# Altium project USB-C_Power_Measurement.PrjPcb
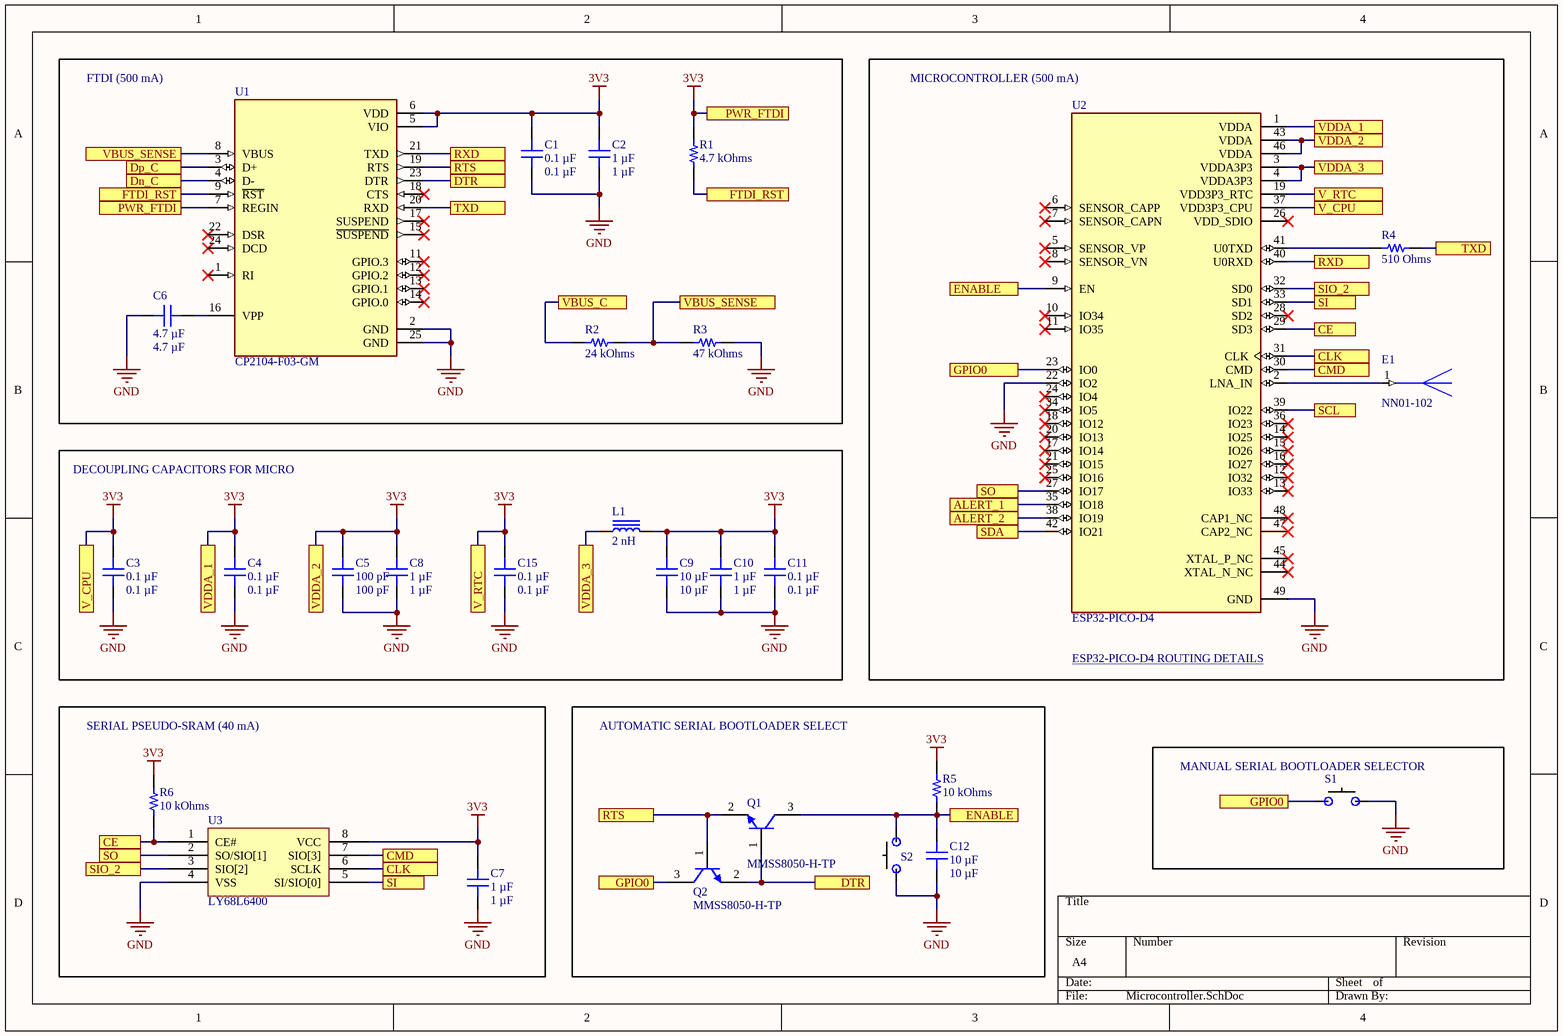
[diagram p0: Microcontroller.SchDoc]
4 sheets, 69 parts. Net scope: flat (ports and power ports of the same name join across sheets).
Board file: PCB_Power_Measurement.PcbDoc
Sheets:
  Microcontroller.SchDoc
  USB-C_Connectors.SchDoc
  Power_Regulation.SchDoc
  Power_Measurement.SchDoc

## Sheet Microcontroller.SchDoc
size A4

### Parts
C1  0.1 µF  [CAP 0603_1608]
C2  1 µF  [CAP 0603_1608]
C3  0.1 µF  [CAP 0603_1608]
C4  0.1 µF  [CAP 0603_1608]
C5  100 pF  [CAP 0603_1608]
C6  4.7 µF  [CAP 0603_1608]
C7  1 µF  [CAP 0603_1608]
C8  1 µF  [CAP 0603_1608]
C9  10 µF  [CAP 0805_2012]
C10  1 µF  [CAP 0603_1608]
C11  0.1 µF  [CAP 0603_1608]
C12  10 µF  [CAP 0805_2012]
C15  0.1 µF  [CAP 0603_1608]
E1  NN01-102  [XCVR_NN01-102]
L1  2 nH  [IND 0402_1005]
Q1  MMSS8050-H-TP  [MCCSEMI SOT-23-3]
Q2  MMSS8050-H-TP  [MCCSEMI SOT-23-3]
R1  4.7 kOhms  [RES 0603_1608]
R2  24 kOhms  [RES 0603_1608]
R3  47 kOhms  [RES 0603_1608]
R4  510 Ohms  [RES 0603_1608]
R5  10 kOhms  [RES 0603_1608]
R6  10 kOhms  [RES 0603_1608]
S1  GT-TC029B-H025-L1N  [GT-TC029B-H025-L1N]  (value not drawn)
S2  GT-TC029B-H025-L1N  [GT-TC029B-H025-L1N]  (value not drawn)
U1  CP2104-F03-GM  [QFN50P400X400X80-25N]
U2  ESP32-PICO-D4  [PQFN50P700X700X104-49N]
U3  LY68L6400  [SOP-8_3.9x4.9x1.27P]

### Blocks framed on the sheet
FTDI (500 mA): C1 C2 C6 R1-R3 U1
DECOUPLING CAPACITORS FOR MICRO: C3-C5 C8-C11 C15 L1
SERIAL PSEUDO-SRAM (40 mA): C7 R6 U3
AUTOMATIC SERIAL BOOTLOADER SELECT: C12 Q1 Q2 R5 S2
MANUAL SERIAL BOOTLOADER SELECTOR: S1

### Ports
ALERT_1, ALERT_2, CE, CLK, CMD, Dn_C, Dp_C, DTR, ENABLE, FTDI_RST, GPIO0, PWR_FTDI, RTS, RXD, SCL, SDA, SI, SIO_2, SO, TXD, V_CPU, V_RTC, VBUS_C, VBUS_SENSE, VDDA_1, VDDA_2, VDDA_3

### Nets
3V3: C1.2 C2.1 C3.2 C4.1 C5.2 C7.1 C8.2 C9.2 C10.2 C11.2 C15.2 L1.2 R1.2 R5.1 R6.1 U1.5(VIO) U1.6(VDD) U1.7(REGIN) U2.1(VDDA) U2.19(VDD3P3_RTC) U2.37(VDD3P3_CPU) U2.43(VDDA) U2.46(VDDA) U3.8(VCC) ; port PWR_FTDI, port V_CPU, port VDDA_1, port VDDA_2, port V_RTC
GND: C1.1 C2.2 C3.1 C4.2 C5.1 C6.2 C7.2 C8.1 C9.1 C10.1 C11.1 C12.1 C15.1 R3.1 S1.2 S2.1 U1.2(GND) U1.25(GND) U2.22(IO2) U2.49(GND) U3.4(VSS)
NetC6_1: C6.1 U1.16(VPP)
NetC12_2: C12.2 Q1.3(C) R5.2 S2.2 U2.9(EN) ; port ENABLE
NetD1_1: U1.3(D+) ; port Dp_C
NetD2_1: U1.4(D-) ; port Dn_C
NetE1_1: E1.1 U2.2(LNA_IN)
NetJ3_A4: R2.2 ; port VBUS_C
NetL1_1: L1.1 U2.3(VDDA3P3) U2.4(VDDA3P3) ; port VDDA_3
NetQ1_1: Q1.1(B) Q2.2(E) U1.23(DTR) ; port DTR
NetQ1_2: Q1.2(E) Q2.1(B) U1.19(RTS) ; port RTS
NetQ2_3: Q2.3(C) S1.1 U2.23(IO0) ; port GPIO0
NetR1_1: R1.1 U1.9(~{RST}) ; port FTDI_RST
NetR2_1: R2.1 R3.2 U1.8(VBUS) ; port VBUS_SENSE
NetR4_1: R4.1 U2.41(U0TXD)
NetR4_2: R4.2 U1.20(RXD) ; port TXD
NetR6_2: R6.2 U2.29(SD3) U3.1(CE#) ; port CE
NetR10_2: U2.42(IO21) ; port SDA
NetR11_2: U2.39(IO22) ; port SCL
NetR12_2: U2.35(IO18) ; port ALERT_1
NetR13_2: U2.38(IO19) ; port ALERT_2
NetU1_21: U1.21(TXD) U2.40(U0RXD) ; port RXD
NetU2_27: U2.27(IO17) U3.2(SO/SIO[1]) ; port SO
NetU2_30: U2.30(CMD) U3.7(SIO[3]) ; port CMD
NetU2_31: U2.31(CLK) U3.6(SCLK) ; port CLK
NetU2_32: U2.32(SD0) U3.3(SIO[2]) ; port SIO_2
NetU2_33: U2.33(SD1) U3.5(SI/SIO[0]) ; port SI

Not connected (* = marked no-connect by the designer): U1 1(RI)* 11(GPIO.3)* 12(GPIO.2)* 13(GPIO.1)* 14(GPIO.0)* 15(~{SUSPEND})* 17(SUSPEND)* 18(CTS)* 22(DSR)* 24(DCD)*; U2 5(SENSOR_VP)* 6(SENSOR_CAPP)* 7(SENSOR_CAPN)* 8(SENSOR_VN)* 10(IO34)* 11(IO35)* 12(IO32)* 13(IO33)* 14(IO25)* 15(IO26)* 16(IO27)* 17(IO14)* 18(IO12)* 20(IO13)* 21(IO15)* 24(IO4)* 25(IO16)* 26(VDD_SDIO)* 28(SD2)* 34(IO5)* 36(IO23)* 44(XTAL_N_NC)* 45(XTAL_P_NC)* 47(CAP2_NC)* 48(CAP1_NC)*

### Notes on the sheet
- (near U2) MICROCONTROLLER (500 mA)
- ESP32-PICO-D4 ROUTING DETAILS <https://espressif.com/sites/default/files/documentation/esp32_hardware_design_guidelines_en.pdf>

### Library data of the parts
C1 C3 C4 C11 C15 = C0603C104K5RAC7411: CAP CER 0.1UF 50V X7R 0603; manufacturer: KEMET; Tolerance: ±10%; Part Number: C0603C104K5RAC7411; Value: 0.1 µF; Applications: Bypass, Decoupling; Capacitance: 0.1 µF; componentlink1description: Datasheet; componentlink1url: https://api.kemet.com/component-edge/download/datasheet/C0603C104K5RAC7411.pdf; componentlink2description: DigiKey Link; componentlink2url: https://www.digikey.com/en/products/detail/kemet/C0603C104K5RAC7411/3317013; Device Package: 0603 (1608 Metric); lastupdated: 21/08/2022 8:00:52 PM; Lifecycle Status: Active; Minimum Order: 15000; Mounting Type: Surface Mount, MLCC; Operating Temperature: -55°C ~ 125°C; Package / Case: 0603 (1608 Metric); packaging: TapeAndReel; partid: 2233; Part Status: Active; price: 0.01; series: SMD Comm X7R; Size / Dimension: 0.063" L x 0.031" W (1.60mm x 0.80mm); Supplier 1: DigiKey; Supplier Part Number 1: 399-7374-2-ND; Temperature Coefficient: X7R; Thickness (Max): 0.035" (0.90mm); Voltage - Rated: 50V
C2 C7 C8 C10 = CC0603KRX7R6BB105: CAP CER 1UF 10V X7R 0603; manufacturer: Yageo; Tolerance: ±10%; Part Number: CC0603KRX7R6BB105; Value: 1 µF; Applications: General Purpose; Capacitance: 1 µF; componentlink1description: Datasheet; componentlink1url: https://www.yageo.com/upload/media/product/productsearch/datasheet/mlcc/UPY-GPHC_X7R_6.3V-to-50V_18.pdf; componentlink2description: DigiKey Link; componentlink2url: https://www.digikey.com/en/products/detail/yageo/CC0603KRX7R6BB105/5195204; Device Package: 0603 (1608 Metric); lastupdated: 21/08/2022 8:00:52 PM; Lifecycle Status: Active; Minimum Order: 1; Mounting Type: Surface Mount, MLCC; Operating Temperature: -55°C ~ 125°C; Package / Case: 0603 (1608 Metric); packaging: TapeAndReel; partid: 2290; Part Status: Active; price: 0.02; series: CC; Size / Dimension: 0.063" L x 0.031" W (1.60mm x 0.80mm); Supplier 1: DigiKey; Supplier Part Number 1: 311-1796-1-ND; Temperature Coefficient: X7R; Thickness (Max): 0.035" (0.90mm); Voltage - Rated: 10V
C5 = C0603C101K5GACAUTO: CAP CER 100PF 50V C0G/NP0 0603; manufacturer: KEMET; Temperature Coefficient: C0G, NP0; Tolerance: ±10%; Part Number: C0603C101K5GACAUTO; Value: 100 pF; Applications: Automotive; Capacitance: 100 pF; componentlink1description: Datasheet; componentlink1url: https://api.kemet.com/component-edge/download/datasheet/C0603C101K5GACAUTO.pdf; componentlink2description: DigiKey Link; componentlink2url: https://www.digikey.com/en/products/detail/kemet/C0603C101K5GACAUTO/3314842; Device Package: 0603 (1608 Metric); Features: Low ESL; lastupdated: 25/08/2022 6:49:41 AM; Lifecycle Status: Active; Minimum Order: 1; Mounting Type: Surface Mount, MLCC; Operating Temperature: -55°C ~ 125°C; Package / Case: 0603 (1608 Metric); packaging: TapeAndReel; partid: 2201; Part Status: Active; price: 0.01; Ratings: AEC-Q200; series: SMD Auto C0G; Size / Dimension: 0.063" L x 0.031" W (1.60mm x 0.80mm); Supplier 1: DigiKey; Supplier Part Number 1: 399-6843-1-ND; Thickness (Max): 0.034" (0.87mm); Voltage - Rated: 50V
C6 = GRM188Z71C475KE21J: CAP CER 4.7UF 16V X7R 0603; manufacturer: Murata Electronics; Tolerance: ±10%; Part Number: GRM188Z71C475KE21J; Value: 4.7 µF; Applications: General Purpose; Capacitance: 4.7 µF; componentlink1description: Datasheet; componentlink1url: https://search.murata.co.jp/Ceramy/image/img/A01X/G101/ENG/GRM188Z71C475KE21-01A.pdf; componentlink2description: DigiKey Link; componentlink2url: https://www.digikey.com/en/products/detail/murata-electronics/GRM188Z71C475KE21J/16033436; Device Package: 0603 (1608 Metric); lastupdated: 21/08/2022 7:59:26 PM; Lifecycle Status: Active; Minimum Order: 1; Mounting Type: Surface Mount, MLCC; Operating Temperature: -55°C ~ 125°C; Package / Case: 0603 (1608 Metric); packaging: TapeAndReel; partid: 41988; Part Status: Active; price: 0.04; series: GRM; Size / Dimension: 0.063" L x 0.031" W (1.60mm x 0.80mm); Supplier 1: DigiKey; Supplier Part Number 1: 490-GRM188Z71C475KE21JCT-ND; Temperature Coefficient: X7R; Thickness (Max): 0.039" (1.00mm); Voltage - Rated: 16V
C9 C12 = CGA4J1X7R0J106K125AC: CAP CER 10UF 6.3V X7R 0805; manufacturer: TDK Corporation; Tolerance: ±10%; Part Number: CGA4J1X7R0J106K125AC; Value: 10 µF; Applications: Automotive; Capacitance: 10 µF; componentlink1description: Datasheet; componentlink1url: https://product.tdk.com/info/en/catalog/datasheets/mlcc_automotive_general_en.pdf?ref_disty=digikey; componentlink2description: DigiKey Link; componentlink2url: https://www.digikey.com/en/products/detail/tdk-corporation/CGA4J1X7R0J106K125AC/2672864; Device Package: 0805 (2012 Metric); lastupdated: 21/08/2022 8:04:19 PM; Lifecycle Status: Active; Minimum Order: 1; Mounting Type: Surface Mount, MLCC; Operating Temperature: -55°C ~ 125°C; Package / Case: 0805 (2012 Metric); packaging: TapeAndReel; partid: 3016; Part Status: Active; price: 0.07; Ratings: AEC-Q200; series: CGA; Size / Dimension: 0.079" L x 0.049" W (2.00mm x 1.25mm); Supplier 1: DigiKey; Supplier Part Number 1: 445-6971-1-ND; Temperature Coefficient: X7R; Thickness (Max): 0.057" (1.45mm); Voltage - Rated: 6.3V
E1 = NN01-102: 2.45GHz Bluetooth, WLAN, Zigbee Chip RF Antenna 2.4GHz ~ 2.5GHz 1.7dBi Solder Surface Mount; MF: {'manufacturer': u'Ignion'}; Availability: Unavailable; Value: *; Price: None; MP: NN01-102; Package: None
L1 = MHQ1005P2N0BT000: FIXED IND 2NH 1A 50 MOHM SMD; Manufacturer: TDK Corporation; DC Resistance (DCR): 50mOhm Max; Frequency - Self Resonant: 8GHz; Inductance Frequency - Test: 100 MHz; Material - Core: Ceramic, Non-Magnetic; Q @ Freq: 23 @ 250MHz; Shielding: Unshielded; Tolerance: ±0.1nH; Type: Multilayer; Part Number: MHQ1005P2N0BT000; ComponentLink1Description: Datasheet; ComponentLink1URL: https://product.tdk.com/info/en/catalog/datasheets/inductor_commercial_high-frequency_mhq1005p_en.pdf?ref_disty=digikey; ComponentLink2Description: DigiKey Link; ComponentLink2URL: https://www.digikey.com/en/products/detail/tdk-corporation/MHQ1005P2N0BT000/4742522; Current Rating (Amps): 1 A; Device Package: 0402 (1005 Metric); Height - Seated (Max): 0.024" (0.60mm); Inductance: 2 nH; LastUpdated: 1/09/2022 1:22:23 PM; Lifecycle Status: Active; Minimum Order: 1; Mounting Type: Surface Mount; Operating Temperature: -55°C ~ 125°C; Package / Case: 0402 (1005 Metric); Packaging: TapeAndReel; PartId: 1330; Part Status: Active; Price: 0.06; Series: MHQ-P; Size / Dimension: 0.039" L x 0.024" W (1.00mm x 0.60mm); Supplier 1: DigiKey; Supplier Part Number 1: 445-MHQ1005P2N0BT000CT-ND; Supplier Device Package: 0402 (1005 Metric); Value: 2 nH
Q1 Q2 = MMSS8050-H-TP: TRANS NPN 25V 1.5A SOT23; Manufacturer: Micro Commercial Co; Current - Collector Cutoff (Max): 100nA; DC Current Gain (hFE) (Min) @ Ic, Vce: 120 @ 100mA, 1V; Frequency - Transition: 100MHz; Power - Max: 625 mW; Vce Saturation (Max) @ Ib, Ic: 500mV @ 80mA, 800mA; Part Number: MMSS8050-H-TP; ComponentLink1Description: Datasheet; ComponentLink1URL: https://www.mccsemi.com/pdf/Products/MMSS8050(SOT-23).pdf; ComponentLink2Description: DigiKey Link; ComponentLink2URL: https://www.digikey.com/en/products/detail/micro-commercial-co/MMSS8050-H-TP/2696476; Current - Collector (Ic) (Max): 1.5 A; LastUpdated: 21/08/2022 9:04:56 PM; Lifecycle Status: Active; Minimum Order: 1; Mounting Type: Surface Mount; Operating Temperature: -55°C ~ 150°C (TJ); Package / Case: TO-236-3, SC-59, SOT-23-3; Packaging: TapeAndReel; PartId: 279; Part Status: Active; Price: 0.03; Series: -; Supplier 1: DigiKey; Supplier Part Number 1: MMSS8050-H-TPMSCT-ND; Supplier Device Package: SOT-23; Transistor Type: NPN; Voltage - Collector Emitter Breakdown (Max): 25 V
R1 = RT0603FRE074K7L: RES SMD 4.7K OHM 1% 1/10W 0603; Manufacturer: Yageo; Power (Watts): 0.1W, 1/10W; Temperature Coefficient: ±50ppm/°C; Part Number: RT0603FRE074K7L; Value: 4.7 kOhms; ComponentLink1Description: Datasheet; ComponentLink1URL: https://www.yageo.com/upload/media/product/productsearch/datasheet/rchip/PYu-RT_1-to-0.01_RoHS_L_11.pdf; ComponentLink2Description: DigiKey Link; ComponentLink2URL: https://www.digikey.com/en/products/detail/yageo/RT0603FRE074K7L/1075404; Composition: Thin Film; Device Package: 0603 (1608 Metric); Height - Seated (Max): 0.022" (0.55mm); LastUpdated: 21/08/2022 8:23:08 PM; Lifecycle Status: Active; Minimum Order: 1; Number of Terminations: 2; Operating Temperature: -55°C ~ 155°C; Package / Case: 0603 (1608 Metric); Packaging: TapeAndReel; PartId: 5678; Part Status: Active; Price: 0.01; Resistance: 4.7 kOhms; Series: RT; Size / Dimension: 0.063" L x 0.031" W (1.60mm x 0.80mm); Supplier 1: DigiKey; Supplier Part Number 1: YAG1238CT-ND; Supplier Device Package: 0603; Tolerance: ±1%
R2 = RK73H1JTTD2402F: RES 24K OHM 1% 1/10W 0603; Manufacturer: KOA Speer Electronics, Inc.; Power (Watts): 0.1W, 1/10W; Temperature Coefficient: ±100ppm/°C; Part Number: RK73H1JTTD2402F; Value: 24 kOhms; ComponentLink1Description: Datasheet; ComponentLink1URL: http://www.koaspeer.com/catimages/Products/RK73H/RK73H.pdf; ComponentLink2Description: DigiKey Link; ComponentLink2URL: https://www.digikey.com/en/products/detail/koa-speer-electronics-inc/RK73H1JTTD2402F/9844964; Composition: Thick Film; Device Package: 0603 (1608 Metric); Features: Automotive AEC-Q200, Moisture Resistant; Height - Seated (Max): 0.022" (0.55mm); LastUpdated: 21/08/2022 8:23:10 PM; Lifecycle Status: Active; Minimum Order: 1; Number of Terminations: 2; Operating Temperature: -55°C ~ 155°C; Package / Case: 0603 (1608 Metric); Packaging: CutTape; PartId: 5156; Part Status: Active; Price: 0.01; Ratings: AEC-Q200; Resistance: 24 kOhms; Series: RK73H; Size / Dimension: 0.063" L x 0.031" W (1.60mm x 0.80mm); Supplier 1: DigiKey; Supplier Part Number 1: 2019-RK73H1JTTD2402FCT-ND; Supplier Device Package: 0603; Tolerance: ±1%
R3 = RT0603FRE0747KL: RES SMD 47K OHM 1% 1/10W 0603; Manufacturer: Yageo; Power (Watts): 0.1W, 1/10W; Temperature Coefficient: ±50ppm/°C; Part Number: RT0603FRE0747KL; Value: 47 kOhms; ComponentLink1Description: Datasheet; ComponentLink1URL: https://www.yageo.com/upload/media/product/productsearch/datasheet/rchip/PYu-RT_1-to-0.01_RoHS_L_11.pdf; ComponentLink2Description: DigiKey Link; ComponentLink2URL: https://www.digikey.com/en/products/detail/yageo/RT0603FRE0747KL/1075386; Composition: Thin Film; Device Package: 0603 (1608 Metric); Height - Seated (Max): 0.022" (0.55mm); LastUpdated: 21/08/2022 8:23:08 PM; Lifecycle Status: Active; Minimum Order: 1; Number of Terminations: 2; Operating Temperature: -55°C ~ 155°C; Package / Case: 0603 (1608 Metric); Packaging: TapeAndReel; PartId: 5674; Part Status: Active; Price: 0.01; Resistance: 47 kOhms; Series: RT; Size / Dimension: 0.063" L x 0.031" W (1.60mm x 0.80mm); Supplier 1: DigiKey; Supplier Part Number 1: YAG3355CT-ND; Supplier Device Package: 0603; Tolerance: ±1%
R4 = RMCF0603JT510R: RES 510 OHM 5% 1/10W 0603; Manufacturer: Stackpole Electronics Inc; Power (Watts): 0.1W, 1/10W; Temperature Coefficient: ±200ppm/°C; Part Number: RMCF0603JT510R; Value: 510 Ohms; ComponentLink1Description: Datasheet; ComponentLink1URL: https://www.seielect.com/catalog/sei-rmcf_rmcp.pdf; ComponentLink2Description: DigiKey Link; ComponentLink2URL: https://www.digikey.com/en/products/detail/stackpole-electronics-inc/RMCF0603JT510R/1757941; Composition: Thick Film; Device Package: 0603 (1608 Metric); Features: Automotive AEC-Q200; Height - Seated (Max): 0.022" (0.55mm); LastUpdated: 25/08/2022 7:11:50 AM; Lifecycle Status: Active; Minimum Order: 1; Number of Terminations: 2; Operating Temperature: -55°C ~ 155°C; Package / Case: 0603 (1608 Metric); Packaging: CutTape; PartId: 5929; Part Status: Active; Price: 0.01; Ratings: AEC-Q200; Resistance: 510 Ohms; Series: RMCF; Size / Dimension: 0.061" L x 0.031" W (1.55mm x 0.80mm); Supplier 1: DigiKey; Supplier Part Number 1: RMCF0603JT510RCT-ND; Supplier Device Package: 0603; Tolerance: ±5%
R5 R6 = RCS060310K0JNEA: RES SMD 10K OHM 5% 1/4W 0603; Manufacturer: Vishay Dale; Power (Watts): 0.25W, 1/4W; Temperature Coefficient: ±200ppm/°C; Part Number: RCS060310K0JNEA; Value: 10 kOhms; ComponentLink1Description: Datasheet; ComponentLink1URL: http://www.vishay.com/docs/20065/rcse3.pdf; ComponentLink2Description: DigiKey Link; ComponentLink2URL: https://www.digikey.com/en/products/detail/vishay-dale/RCS060310K0JNEA/5866963; Composition: Thick Film; Device Package: 0603 (1608 Metric); Features: Automotive AEC-Q200, Pulse Withstanding; Height - Seated (Max): 0.020" (0.50mm); LastUpdated: 25/08/2022 7:11:51 AM; Lifecycle Status: Active; Minimum Order: 1; Number of Terminations: 2; Operating Temperature: -55°C ~ 155°C; Package / Case: 0603 (1608 Metric); Packaging: TapeAndReel; PartId: 5383; Part Status: Active; Price: 0.01; Ratings: AEC-Q200; Resistance: 10 kOhms; Series: RCS e3; Size / Dimension: 0.061" L x 0.033" W (1.55mm x 0.85mm); Supplier 1: DigiKey; Supplier Part Number 1: 541-2817-1-ND; Supplier Device Package: 0603; Tolerance: ±5%
S1 S2 = GT-TC029B-H025-L1N: No NO SMDSplicing 50mA 3.9mm 100MΩ 100000 12V 250gf@±30gf 2.9mm -30℃~+85℃ 2.5mm Black Round Button Brick nogging SPST SMD Tactile Switches ROHS
U1 = CP2104-F03-GM: USB-to-UART 1-CH 576byte FIFO 3.3V 24-Pin QFN EP T/R; MF: {'manufacturer': u'Silicon Labs'}; Value: *; MP: CP2104-F03-GM; Package: None; Price: None; Availability: Unavailable
U2 = ESP32-PICO-D4: Bluetooth, WiFi 802.11b/g/n, Bluetooth v4.2 +EDR, Class 1, 2 and 3 Transceiver Module 2.4GHz ~ 2.5GHz Surface Mount; MF: {'manufacturer': u'Espressif Systems'}; Price: None; Value: *; Package: None; Availability: Unavailable; MP: ESP32-PICO-D4
U3 = LY68L6400SLIT: 64M Bits Serial Pseudo-SRAM with SPI and QPI

## Sheet USB-C_Connectors.SchDoc
size A4
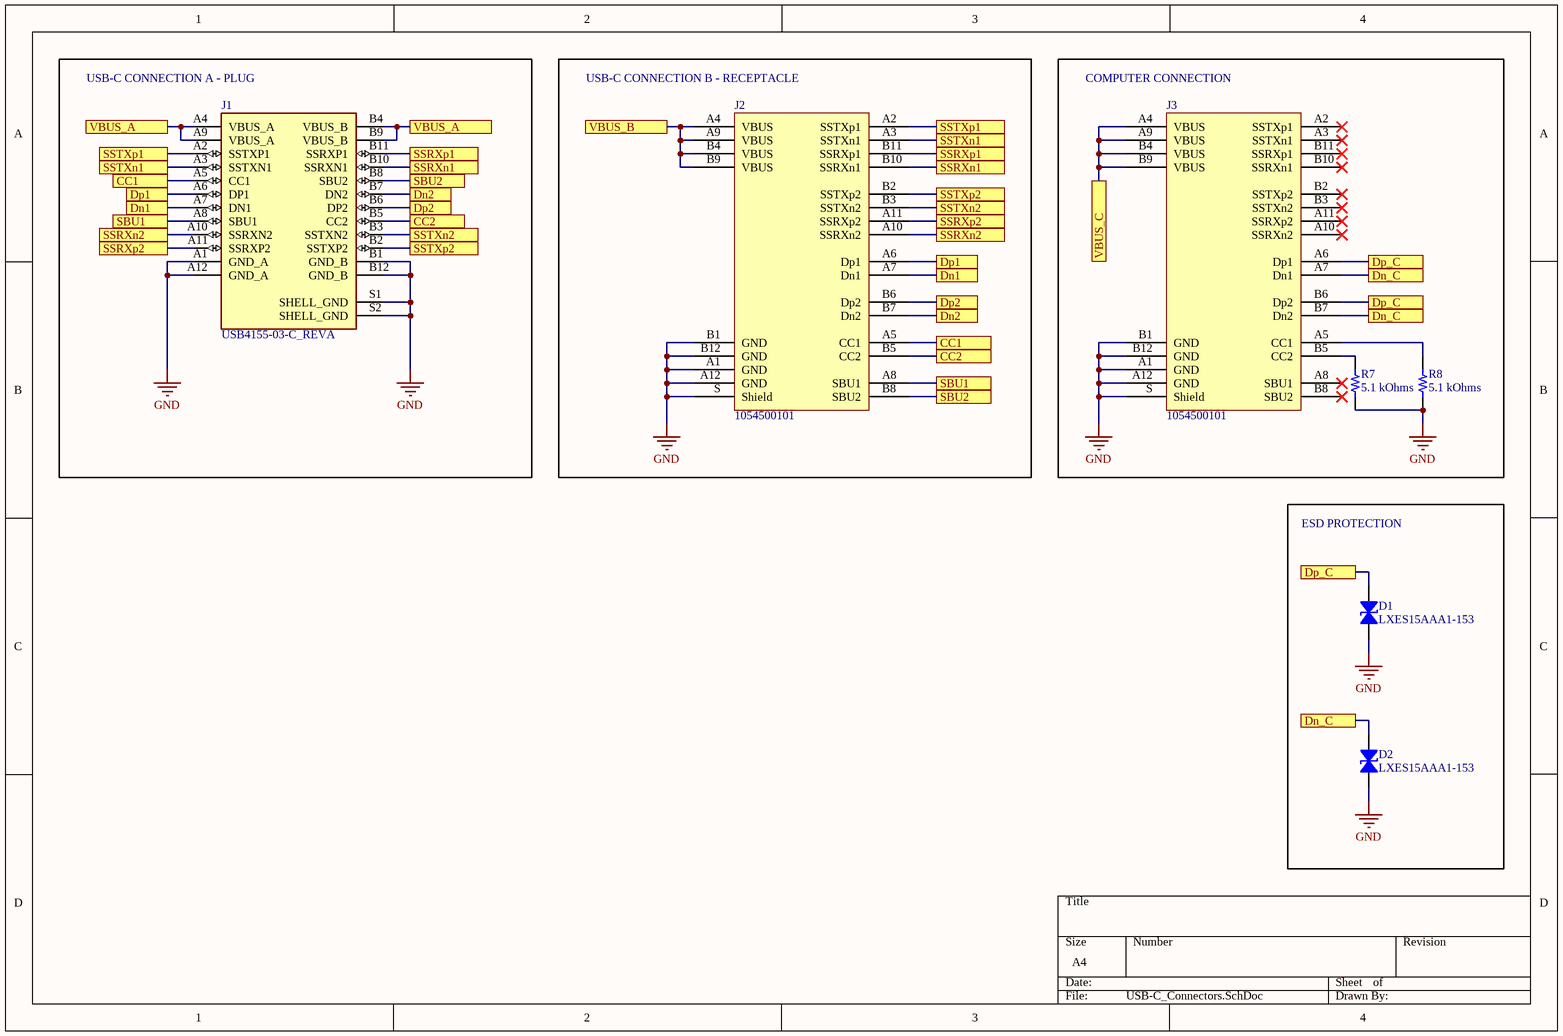
[diagram p1: USB-C_Connectors.SchDoc]

### Parts
D1  LXES15AAA1-153  [0402]
D2  LXES15AAA1-153  [0402]
J1  USB4155-03-C_REVA  [GCT_USB4155-03-C_REVA]
J2  1054500101  [Molex 1054500101]
J3  1054500101  [Molex 1054500101]
R7  5.1 kOhms  [RES 0603_1608]
R8  5.1 kOhms  [RES 0603_1608]

### Blocks framed on the sheet
USB-C CONNECTION A - PLUG: J1
USB-C CONNECTION B - RECEPTACLE: J2
COMPUTER CONNECTION: J3 R7 R8
ESD PROTECTION: D1 D2

### Ports
CC1, CC2, Dn1, Dn2, Dn_C, Dp1, Dp2, Dp_C, SBU1, SBU2, SSRXn1, SSRXn2, SSRXp1, SSRXp2, SSTXn1, SSTXn2, SSTXp1, SSTXp2, VBUS_A, VBUS_B, VBUS_C

### Nets
GND: D1.2 D2.2 J1.A1(GND_A) J1.A12(GND_A) J1.B1(GND_B) J1.B12(GND_B) J1.S1(SHELL_GND) J1.S2(SHELL_GND) J2.A1(GND) J2.A12(GND) J2.B1(GND) J2.B12(GND) J2.S(Shield) J3.A1(GND) J3.A12(GND) J3.B1(GND) J3.B12(GND) J3.S(Shield) R7.1 R8.2
NetD1_1: D1.1 J3.A6(Dp1) J3.B6(Dp2) ; port Dp_C
NetD2_1: D2.1 J3.A7(Dn1) J3.B7(Dn2) ; port Dn_C
NetJ1_A2: J1.A2(SSTXP1) J2.A2(SSTXp1) ; port SSTXp1
NetJ1_A3: J1.A3(SSTXN1) J2.A3(SSTXn1) ; port SSTXn1
NetJ1_A4: J1.A4(VBUS_A) J1.A9(VBUS_A) J1.B4(VBUS_B) J1.B9(VBUS_B) ; port VBUS_A
NetJ1_A5: J1.A5(CC1) J2.A5(CC1) ; port CC1
NetJ1_A6: J1.A6(DP1) J2.A6(Dp1) ; port Dp1
NetJ1_A7: J1.A7(DN1) J2.A7(Dn1) ; port Dn1
NetJ1_A8: J1.A8(SBU1) J2.A8(SBU1) ; port SBU1
NetJ1_A10: J1.A10(SSRXN2) J2.A10(SSRXn2) ; port SSRXn2
NetJ1_A11: J1.A11(SSRXP2) J2.A11(SSRXp2) ; port SSRXp2
NetJ1_B2: J1.B2(SSTXP2) J2.B2(SSTXp2) ; port SSTXp2
NetJ1_B3: J1.B3(SSTXN2) J2.B3(SSTXn2) ; port SSTXn2
NetJ1_B5: J1.B5(CC2) J2.B5(CC2) ; port CC2
NetJ1_B6: J1.B6(DP2) J2.B6(Dp2) ; port Dp2
NetJ1_B7: J1.B7(DN2) J2.B7(Dn2) ; port Dn2
NetJ1_B8: J1.B8(SBU2) J2.B8(SBU2) ; port SBU2
NetJ1_B10: J1.B10(SSRXN1) J2.B10(SSRXn1) ; port SSRXn1
NetJ1_B11: J1.B11(SSRXP1) J2.B11(SSRXp1) ; port SSRXp1
NetJ2_A4: J2.A4(VBUS) J2.A9(VBUS) J2.B4(VBUS) J2.B9(VBUS) ; port VBUS_B
NetJ3_A4: J3.A4(VBUS) J3.A9(VBUS) J3.B4(VBUS) J3.B9(VBUS) ; port VBUS_C
NetJ3_A5: J3.A5(CC1) R8.1
NetJ3_B5: J3.B5(CC2) R7.2

Not connected (* = marked no-connect by the designer): J3 A2(SSTXp1)* A3(SSTXn1)* A8(SBU1)* A10(SSRXn2)* A11(SSRXp2)* B2(SSTXp2)* B3(SSTXn2)* B8(SBU2)* B10(SSRXn1)* B11(SSRXp1)*

### Library data of the parts
D1 D2 = LXES15AAA1-153: TVS DIODE 4V 1005; Manufacturer: Murata Electronics; Bidirectional Channels: 1; Capacitance @ Frequency: 0.05pF @ 1MHz; Power Line Protection: No; Type: Zener; Part Number: LXES15AAA1-153; Applications: General Purpose; ComponentLink1Description: Datasheet; ComponentLink1URL: https://www.murata.com/en-us/products/productdata/8796832759838/CRESD-E.pdf; ComponentLink2Description: DigiKey Link; ComponentLink2URL: http://digikey.com/product-detail/en/murata-electronics/LXES15AAA1-153/490-13210-2-ND/5843762; Device Package: 0402 (1005 Metric); LastUpdated: 9/08/2022 12:53:02 PM; Lifecycle Status: Active; Minimum Order: 0; Mounting Type: Surface Mount; Operating Temperature: -40°C ~ 85°C (TA); Package / Case: 0402 (1005 Metric); Packaging: TapeAndReel; PartId: 10448; Part Status: Active; Price: 0.04; Series: -; Supplier 1: DigiKey; Supplier Part Number 1: 490-13210-2-ND; Supplier Device Package: 1005; Voltage - Reverse Standoff (Typ): 4V
J1 = USB4155-03-C_REVA: MF: {'manufacturer': u'Global Connector Technology'}; Value: *; Availability: Unavailable; Package: None; MP: USB4155-03-C_REVA; Price: None
J2 J3 = 1054500101: CONN RCP USB3.1 TYPEC 24P SMD RA; Manufacturer: Molex; Connector Type: USB - C (Type - C); Current Rating (Amps): 0.25A, 1A, 5A; Gender: Receptacle; Mating Cycles: 10000; Number of Contacts: 24; Number of Ports: 1; Shielding: Shielded; Specifications: USB 3.1 (USB 3.1 Gen 2, Superspeed+); Voltage - Rated: 30VAC/DC; Part Number: 1054500101; ComponentLink1Description: Datasheet; ComponentLink1URL: https://www.molex.com/pdm_docs/ps/PS-105448-001.pdf; ComponentLink2Description: DigiKey Link; ComponentLink2URL: http://digikey.com/product-detail/en/molex/1054500101/WM12856CT-ND/5843891; LastUpdated: 6/06/2020 2:14:04 AM; Lifecycle Status: Active; Minimum Order: 1; Mounting Feature: Horizontal; Mounting Type: Surface Mount, Right Angle; Through Hole; Operating Temperature: -30°C ~ 85°C; Packaging: TapeAndReel; Part Status: Active; Price: 1.22; Series: 105445; Supplier 1: DigiKey; Supplier Part Number 1: WM12856CT-ND; Termination: Solder
R7 R8 = RK73B1JTTD512J: RES 5.1K OHM 5% 1/10W 0603; Manufacturer: KOA Speer Electronics, Inc.; Power (Watts): 0.1W, 1/10W; Temperature Coefficient: ±200ppm/°C; Part Number: RK73B1JTTD512J; Value: 5.1 kOhms; ComponentLink1Description: Datasheet; ComponentLink1URL: http://www.koaspeer.com/catimages/Products/RK73B/RK73B.pdf; ComponentLink2Description: DigiKey Link; ComponentLink2URL: https://www.digikey.com/en/products/detail/koa-speer-electronics-inc/RK73B1JTTD512J/9844732; Composition: Thick Film; Device Package: 0603 (1608 Metric); Features: Automotive AEC-Q200; Height - Seated (Max): 0.022" (0.55mm); LastUpdated: 25/08/2022 7:11:50 AM; Lifecycle Status: Active; Minimum Order: 1; Number of Terminations: 2; Operating Temperature: -55°C ~ 155°C; Package / Case: 0603 (1608 Metric); Packaging: CutTape; PartId: 5969; Part Status: Active; Price: 0.01; Ratings: AEC-Q200; Resistance: 5.1 kOhms; Series: RK73B; Size / Dimension: 0.063" L x 0.031" W (1.60mm x 0.80mm); Supplier 1: DigiKey; Supplier Part Number 1: 2019-RK73B1JTTD512JCT-ND; Supplier Device Package: 0603; Tolerance: ±5%

## Sheet Power_Regulation.SchDoc
size A4
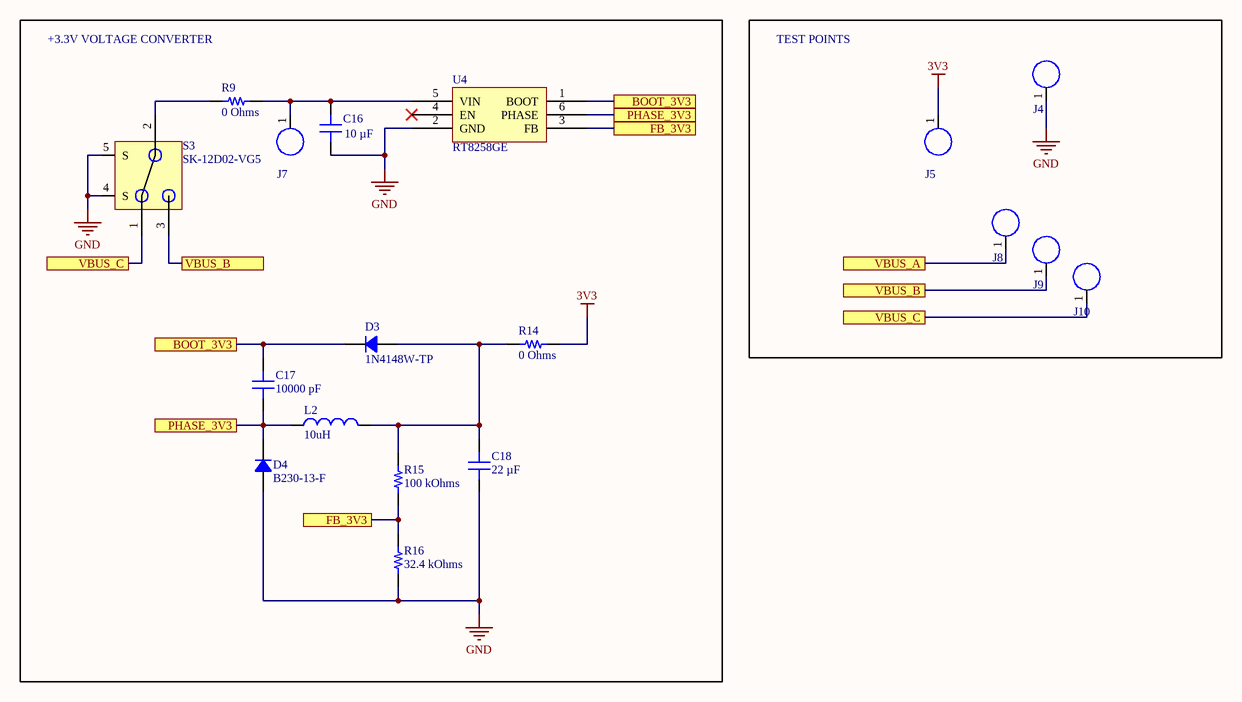
[diagram p2: Power_Regulation.SchDoc]

### Parts
C16  10 µF  [CAP 1206_3216 - 0.8MM]
C17  10000 pF  [CAP 0402_1005]
C18  22 µF  [CAP 1206_3216 - 0.8MM]
D3  1N4148W-TP  [SOD-123]
D4  B230-13-F  [DO214AA SMB]
J4  Large Board Solder Point  [Large Solder Point]  (value not drawn)  (no BOM)
J5  Large Board Solder Point  [Large Solder Point]  (value not drawn)  (no BOM)
J7  Large Board Solder Point  [Large Solder Point]  (value not drawn)  (no BOM)
J8  Large Board Solder Point  [Large Solder Point]  (value not drawn)  (no BOM)
J9  Large Board Solder Point  [Large Solder Point]  (value not drawn)  (no BOM)
J10  Large Board Solder Point  [Large Solder Point]  (value not drawn)  (no BOM)
L2  10uH  [0630CDMCCDS-100MC]
R9  0 Ohms  [RES 1210_3225]
R14  0 Ohms  [RES 1210_3225]
R15  100 kOhms  [RES 0402_1005]
R16  32.4 kOhms  [RES 0402_1005]
S3  SK-12D02-VG5  [SK-12D02-VG5]
U4  RT8258GE  [SOT100P279X130-6N]

### Blocks framed on the sheet
+3.3V VOLTAGE CONVERTER: C16-C18 D3 D4 J7 L2 R9 R14-R16 S3 U4
TEST POINTS: J4 J5 J8-J10

### Ports
BOOT_3V3, FB_3V3, PHASE_3V3, VBUS_A, VBUS_B, VBUS_C

### Nets
3V3: J5.1 R14.2
GND: C16.1 C18.2 D4.1 J4.1 R16.1 S3.4(S) S3.5(S) U4.2(GND)
NetC16_2: C16.2 J7.1 R9.2 U4.5(VIN)
NetC17_1: C17.1 D4.2 L2.1 U4.6(PHASE) ; port PHASE_3V3
NetC17_2: C17.2 D3.2 U4.1(BOOT) ; port BOOT_3V3
NetC18_1: C18.1 D3.1 L2.2 R14.1 R15.2
NetJ1_A4: J8.1 ; port VBUS_A
NetJ2_A4: J9.1 S3.3 ; port VBUS_B
NetJ3_A4: J10.1 S3.1 ; port VBUS_C
NetR9_1: R9.1 S3.2(C)
NetR15_1: R15.1 R16.2 U4.3(FB) ; port FB_3V3

Not connected (* = marked no-connect by the designer): U4 4(EN)*

### Library data of the parts
C16 = GRM31CR71E106MA12K: CAP CER 10UF 25V X7R 1206; manufacturer: Murata Electronics; Tolerance: ±20%; Part Number: GRM31CR71E106MA12K; Value: 10 µF; Applications: General Purpose; Capacitance: 10 µF; componentlink1description: Datasheet; componentlink1url: https://search.murata.co.jp/Ceramy/image/img/A01X/G101/ENG/GRM31CR71E106MA12-01CA.pdf; componentlink2description: DigiKey Link; componentlink2url: https://www.digikey.com/en/products/detail/murata-electronics/GRM31CR71E106MA12K/13904832; Device Package: 1206 (3216 Metric); lastupdated: 9/08/2022 12:05:16 PM; Lifecycle Status: Active; Minimum Order: 1; Mounting Type: Surface Mount, MLCC; Operating Temperature: -55°C ~ 125°C; Package / Case: 1206 (3216 Metric); packaging: TapeAndReel; partid: 30277; Part Status: Active; price: 0.07; series: GRM; Size / Dimension: 0.126" L x 0.063" W (3.20mm x 1.60mm); Supplier 1: DigiKey; Supplier Part Number 1: 490-GRM31CR71E106MA12KCT-ND; Temperature Coefficient: X7R; Thickness (Max): 0.071" (1.80mm); Voltage - Rated: 25V
C17 = VJ0402Y103JXQCW1BC: CAP CER 10000PF 10V X7R 0402; manufacturer: Vishay Vitramon; Tolerance: ±5%; Part Number: VJ0402Y103JXQCW1BC; Value: 10000 pF; Applications: General Purpose; Capacitance: 10000 pF; componentlink1description: Datasheet; componentlink1url: https://www.vishay.com/docs/28548/vjw1bcbascomseries.pdf; componentlink2description: DigiKey Link; componentlink2url: https://www.digikey.com/en/products/detail/vishay-vitramon/VJ0402Y103JXQCW1BC/8301965; Device Package: 0402 (1005 Metric); lastupdated: 9/08/2022 12:01:13 PM; Lifecycle Status: Active; Minimum Order: 1; Mounting Type: Surface Mount, MLCC; Operating Temperature: -55°C ~ 125°C; Package / Case: 0402 (1005 Metric); packaging: TapeAndReel; partid: 4459; Part Status: Active; price: 0.01; series: VJ; Size / Dimension: 0.039" L x 0.020" W (1.00mm x 0.50mm); Supplier 1: DigiKey; Supplier Part Number 1: 720-1645-1-ND; Temperature Coefficient: X7R; Thickness (Max): 0.022" (0.55mm); Voltage - Rated: 10V
C18 = GCM31CR70J226KE23L: CAP CER 22UF 6.3V X7R 1206; manufacturer: Murata Electronics; Tolerance: ±10%; Part Number: GCM31CR70J226KE23L; Value: 22 µF; Applications: Automotive; Capacitance: 22 µF; componentlink1description: Datasheet; componentlink1url: https://www.murata.com/~/media/webrenewal/support/library/catalog/products/capacitor/mlcc/c03e.ashx?la=en-us; componentlink2description: DigiKey Link; componentlink2url: https://www.digikey.com/en/products/detail/murata-electronics/GCM31CR70J226KE23L/1763914; Device Package: 1206 (3216 Metric); lastupdated: 9/08/2022 12:05:38 PM; Lifecycle Status: Active; Minimum Order: 1; Mounting Type: Surface Mount, MLCC; Operating Temperature: -55°C ~ 125°C; Package / Case: 1206 (3216 Metric); packaging: TapeAndReel; partid: 19505; Part Status: Active; price: 0.19; Ratings: AEC-Q200; series: GCM; Size / Dimension: 0.126" L x 0.063" W (3.20mm x 1.60mm); Supplier 1: DigiKey; Supplier Part Number 1: 490-4843-1-ND; Temperature Coefficient: X7R; Thickness (Max): 0.071" (1.80mm); Voltage - Rated: 6.3V
D3 = 1N4148W-TP: DIODE GEN PURP 100V 150MA SOD123; Manufacturer: Micro Commercial Co; Capacitance @ Vr, F: 2pF @ 0V, 1MHz; Current - Reverse Leakage @ Vr: 1 µA @ 75 V; Diode Type: Standard; Reverse Recovery Time (trr): 4 ns; Speed: Small Signal =< 200mA (Io), Any Speed; Voltage - Forward (Vf) (Max) @ If: 1.25 V @ 150 mA; Part Number: 1N4148W-TP; ComponentLink1Description: Datasheet; ComponentLink1URL: https://www.mccsemi.com/pdf/Products/1N4148W(SOD123).pdf; ComponentLink2Description: DigiKey Link; ComponentLink2URL: https://www.digikey.com/en/products/detail/micro-commercial-co/1N4148W-TP/717196; Current - Average Rectified (Io): 150mA; LastUpdated: 9/08/2022 12:37:52 PM; Lifecycle Status: Active; Minimum Order: 1; Mounting Type: Surface Mount; Operating Temperature - Junction: -65°C ~ 150°C; Package / Case: SOD-123; Packaging: TapeAndReel; PartId: 999; Part Status: Active; Price: 0.02; Series: -; Supplier 1: DigiKey; Supplier Part Number 1: 1N4148WTPMSCT-ND; Supplier Device Package: SOD-123; Voltage - DC Reverse (Vr) (Max): 100 V
D4 = B230-13-F: DIODE SCHOTTKY 30V 2A SMB; Manufacturer: Diodes Incorporated; Capacitance @ Vr, F: 200pF @ 4V, 1MHz; Current - Reverse Leakage @ Vr: 500 µA @ 30 V; Speed: Fast Recovery =< 500ns, > 200mA (Io); Voltage - Forward (Vf) (Max) @ If: 500 mV @ 2 A; Part Number: B230-13-F; ComponentLink1Description: Datasheet; ComponentLink1URL: https://www.diodes.com/assets/Datasheets/ds13004.pdf; ComponentLink2Description: DigiKey Link; ComponentLink2URL: https://www.digikey.com/en/products/detail/diodes-incorporated/B230-13-F/814955; Current - Average Rectified (Io): 2A; Diode Type: Schottky; LastUpdated: 9/08/2022 12:37:20 PM; Lifecycle Status: Active; Minimum Order: 1; Mounting Type: Surface Mount; Operating Temperature - Junction: -65°C ~ 150°C; Package / Case: DO-214AA, SMB; Packaging: TapeAndReel; PartId: 1539; Part Status: Active; Price: 0.13; Series: -; Supplier 1: DigiKey; Supplier Part Number 1: B230-FDICT-ND; Supplier Device Package: SMB; Voltage - DC Reverse (Vr) (Max): 30 V
L2 = 0630CDMCCDS-100MC: 4A 10uH ±20% 67mΩ SMD,7x6.6x2.8mm Power Inductors ROHS
R9 R14 = RC1210JR-070RL: RES 0 OHM JUMPER 1/2W 1210; Manufacturer: Yageo; Power (Watts): 0.5W, 1/2W; Part Number: RC1210JR-070RL; ComponentLink1Description: Datasheet; ComponentLink1URL: https://www.yageo.com/upload/media/product/productsearch/datasheet/rchip/PYu-RC_Group_51_RoHS_L_10.pdf; ComponentLink2Description: DigiKey Link; ComponentLink2URL: https://www.digikey.com/en/products/detail/yageo/RC1210JR-070RL/5919839; Composition: Thick Film; Device Package: 1210 (3225 Metric); Features: Moisture Resistant; Height - Seated (Max): 0.024" (0.60mm); LastUpdated: 9/08/2022 12:50:16 PM; Lifecycle Status: Active; Minimum Order: 1; Number of Terminations: 2; Operating Temperature: -55°C ~ 155°C; Package / Case: 1210 (3225 Metric); Packaging: TapeAndReel; Part Status: Active; Price: 0.01; Resistance: 0 Ohms; Series: RC_L; Size / Dimension: 0.122" L x 0.102" W (3.10mm x 2.60mm); Supplier 1: DigiKey; Supplier Part Number 1: YAG3375CT-ND; Supplier Device Package: 1210; Tolerance: Jumper; Value: 0 Ohms
R15 = RP73PF1E100KBTD: RES 100K OHM 0.1% 1/10W 0402; Manufacturer: TE Connectivity Passive Product; Power (Watts): 0.1W, 1/10W; Temperature Coefficient: ±25ppm/°C; Part Number: RP73PF1E100KBTD; Value: 100 kOhms; ComponentLink1Description: Datasheet; ComponentLink1URL: https://www.te.com/commerce/DocumentDelivery/DDEController?Action=srchrtrv&DocNm=1773272&DocType=DS&DocLang=English; ComponentLink2Description: DigiKey Link; ComponentLink2URL: https://www.digikey.com/en/products/detail/te-connectivity-passive-product/RP73PF1E100KBTD/8261053; Composition: Thin Film; Device Package: 0402 (1005 Metric); Height - Seated (Max): 0.014" (0.35mm); LastUpdated: 9/08/2022 12:11:04 PM; Lifecycle Status: Active; Minimum Order: 1; Number of Terminations: 2; Operating Temperature: -55°C ~ 155°C; Package / Case: 0402 (1005 Metric); Packaging: TapeAndReel; PartId: 2436; Part Status: Active; Price: 0.09; Resistance: 100 kOhms; Series: RP73, Holsworthy; Size / Dimension: 0.039" L x 0.020" W (1.00mm x 0.50mm); Supplier 1: DigiKey; Supplier Part Number 1: A127511CT-ND; Supplier Device Package: 0402; Tolerance: ±0.1%
R16 = CPF0402B32K4E1: RES SMD 32.4KOHM 0.1% 1/16W 0402; Manufacturer: TE Connectivity Passive Product; Power (Watts): 0.063W, 1/16W; Temperature Coefficient: ±25ppm/°C; Part Number: CPF0402B32K4E1; Value: 32.4 kOhms; ComponentLink1Description: Datasheet; ComponentLink1URL: https://www.te.com/commerce/DocumentDelivery/DDEController?Action=srchrtrv&DocNm=1773200&DocType=DS&DocLang=English; ComponentLink2Description: DigiKey Link; ComponentLink2URL: https://www.digikey.com/en/products/detail/te-connectivity-passive-product/CPF0402B32K4E1/2382531; Composition: Thin Film; Device Package: 0402 (1005 Metric); Height - Seated (Max): 0.014" (0.35mm); LastUpdated: 9/08/2022 12:10:59 PM; Lifecycle Status: Active; Minimum Order: 1; Number of Terminations: 2; Operating Temperature: -55°C ~ 155°C; Package / Case: 0402 (1005 Metric); Packaging: TapeAndReel; PartId: 4116; Part Status: Active; Price: 0.15; Resistance: 32.4 kOhms; Series: CPF, Neohm; Size / Dimension: 0.039" L x 0.020" W (1.00mm x 0.50mm); Supplier 1: DigiKey; Supplier Part Number 1: A102795CT-ND; Supplier Device Package: 0402; Tolerance: ±0.1%
S3 = SK-12D02-VG5: Lying SPDT 9.5mm PCPin 5000 Rectangular columnar -25℃~+70℃ Plugin Slide Switches ROHS SP#C136722
U4 = RT8258GE: RICHTEK 1.2A, 24V, 700kHz Step-Down Converter SOT23-6

## Sheet Power_Measurement.SchDoc
size A4
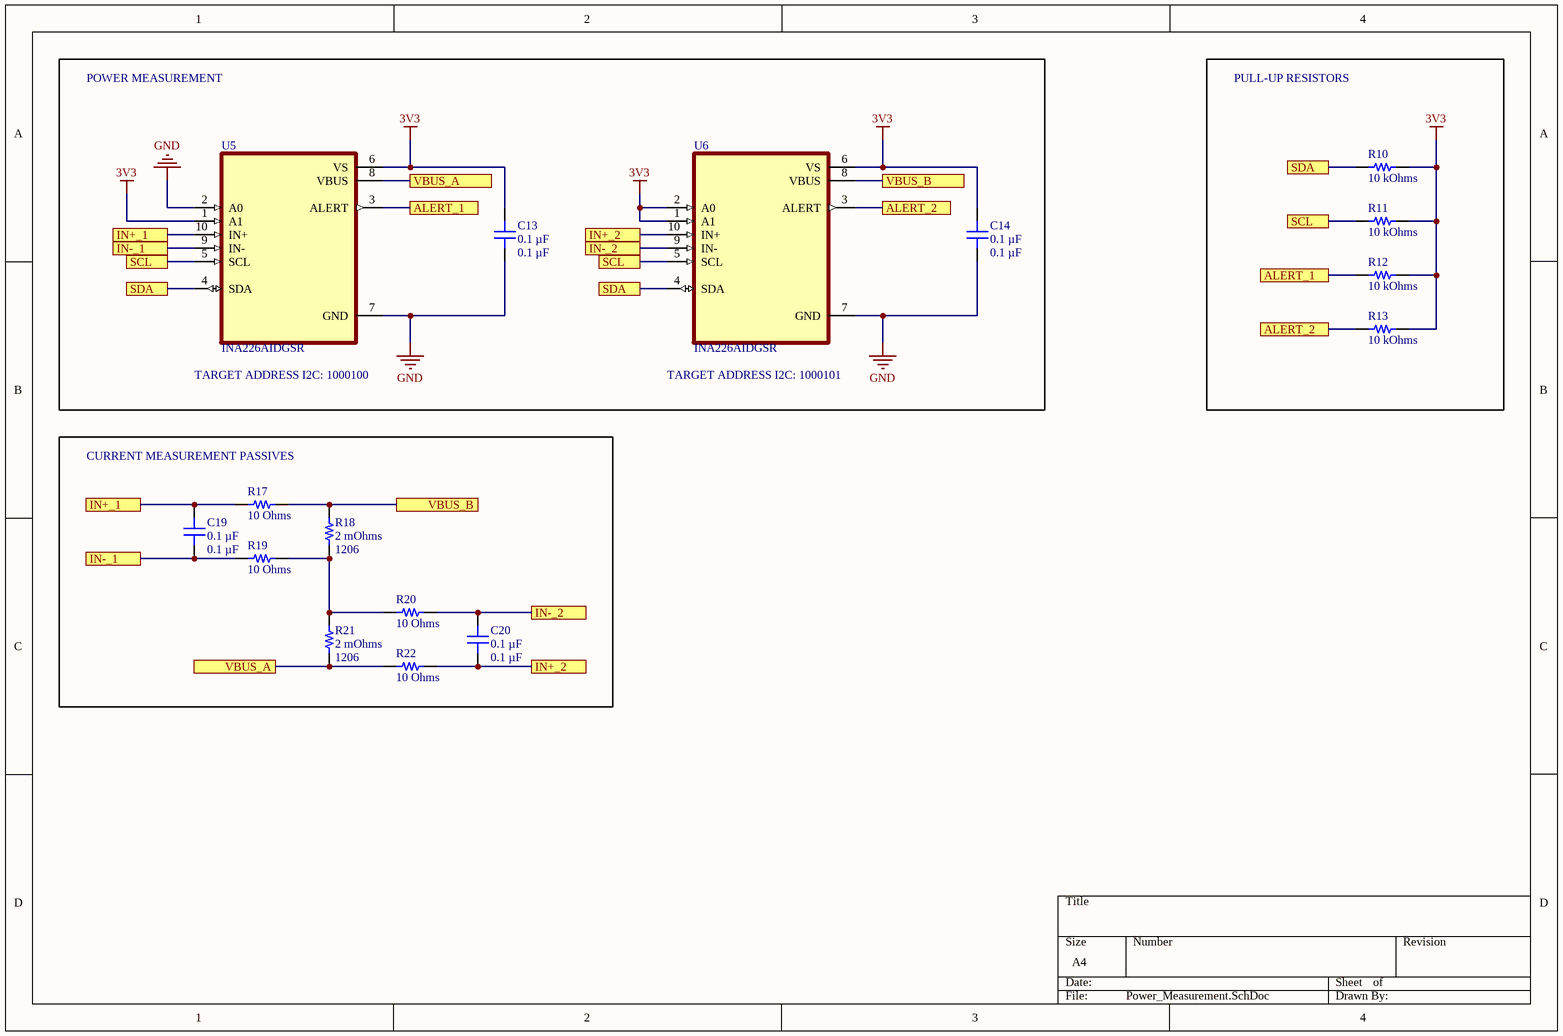
[diagram p3: Power_Measurement.SchDoc]

### Parts
C13  0.1 µF  [CAP 0603_1608]
C14  0.1 µF  [CAP 0603_1608]
C19  0.1 µF  [CAP 0603_1608]
C20  0.1 µF  [CAP 0603_1608]
R10  10 kOhms  [RES 0603_1608]
R11  10 kOhms  [RES 0603_1608]
R12  10 kOhms  [RES 0603_1608]
R13  10 kOhms  [RES 0603_1608]
R17  10 Ohms  [RES 0603_1608]
R18  2 mOhms  Package / Case: 1206  [STACKPOLE CSR1206]
R19  10 Ohms  [RES 0603_1608]
R20  10 Ohms  [RES 0603_1608]
R21  2 mOhms  Package / Case: 1206  [STACKPOLE CSR1206]
R22  10 Ohms  [RES 0603_1608]
U5  INA226AIDGSR  [SOP50P490X110-10N]
U6  INA226AIDGSR  [SOP50P490X110-10N]

### Blocks framed on the sheet
PULL-UP RESISTORS: R10-R13
CURRENT MEASUREMENT PASSIVES: C19 C20 R17-R22

### Ports
ALERT_1, ALERT_2, IN+_1, IN+_2, IN-_1, IN-_2, SCL, SDA, VBUS_A, VBUS_B

### Nets
3V3: C13.1 C14.2 R10.1 R11.1 R12.1 R13.1 U5.1(A1) U5.6(VS) U6.1(A1) U6.2(A0) U6.6(VS)
GND: C13.2 C14.1 U5.2(A0) U5.7(GND) U6.7(GND)
NetC19_1: C19.1 R19.2 U5.9(IN-) ; port IN-_1
NetC19_2: C19.2 R17.2 U5.10(IN+) ; port IN+_1
NetC20_1: C20.1 R20.2 U6.9(IN-) ; port IN-_2
NetC20_2: C20.2 R22.2 U6.10(IN+) ; port IN+_2
NetJ1_A4: R21.1 R22.1 U5.8(VBUS) ; port VBUS_A
NetJ2_A4: R17.1 R18.2 U6.8(VBUS) ; port VBUS_B
NetR10_2: R10.2 U5.4(SDA) U6.4(SDA) ; port SDA
NetR11_2: R11.2 U5.5(SCL) U6.5(SCL) ; port SCL
NetR12_2: R12.2 U5.3(ALERT) ; port ALERT_1
NetR13_2: R13.2 U6.3(ALERT) ; port ALERT_2
NetR18_1: R18.1 R19.1 R20.1 R21.2

### Notes on the sheet
- POWER MEASUREMENT
- TARGET ADDRESS I2C: 1000100
- TARGET ADDRESS I2C: 1000101

### Library data of the parts
C13 C14 C19 C20 = C0603C104K5RAC7411: as C1 on sheet Microcontroller; Part Number: C0603C104K5RAC7411; Value: 0.1 µF; Applications: Bypass, Decoupling; Capacitance: 0.1 µF; componentlink1description: Datasheet; componentlink1url: https://api.kemet.com/component-edge/download/datasheet/C0603C104K5RAC7411.pdf; componentlink2description: DigiKey Link; componentlink2url: https://www.digikey.com/en/products/detail/kemet/C0603C104K5RAC7411/3317013; Device Package: 0603 (1608 Metric); lastupdated: 21/08/2022 8:00:52 PM; Lifecycle Status: Active; Minimum Order: 15000; Mounting Type: Surface Mount, MLCC; Operating Temperature: -55°C ~ 125°C; Package / Case: 0603 (1608 Metric); packaging: TapeAndReel; partid: 2233; Part Status: Active; price: 0.01; series: SMD Comm X7R; Size / Dimension: 0.063" L x 0.031" W (1.60mm x 0.80mm); Supplier 1: DigiKey; Supplier Part Number 1: 399-7374-2-ND; Temperature Coefficient: X7R; Thickness (Max): 0.035" (0.90mm); Voltage - Rated: 50V
R10-R13 = RNCS0603BKE10K0: RES 10K OHM 0.1% 1/16W 0603; Manufacturer: Stackpole Electronics Inc; Power (Watts): 0.063W, 1/16W; Temperature Coefficient: ±25ppm/°C; Part Number: RNCS0603BKE10K0; Value: 10 kOhms; ComponentLink1Description: Datasheet; ComponentLink1URL: https://www.seielect.com/catalog/sei-rncs_rnch.pdf; ComponentLink2Description: DigiKey Link; ComponentLink2URL: https://www.digikey.com/en/products/detail/stackpole-electronics-inc/RNCS0603BKE10K0/1708836; Composition: Thin Film; Device Package: 0603 (1608 Metric); Features: Anti-Corrosive, Automotive AEC-Q200, Moisture Resistant; Height - Seated (Max): 0.022" (0.55mm); LastUpdated: 27/08/2022 7:54:13 AM; Lifecycle Status: Active; Minimum Order: 1; Number of Terminations: 2; Operating Temperature: -55°C ~ 155°C; Package / Case: 0603 (1608 Metric); Packaging: TapeAndReel; PartId: 4838; Part Status: Active; Price: 0.08; Ratings: AEC-Q200; Resistance: 10 kOhms; Series: RNCS; Size / Dimension: 0.061" L x 0.031" W (1.55mm x 0.80mm); Supplier 1: DigiKey; Supplier Part Number 1: RNCS0603BKE10K0CT-ND; Supplier Device Package: 0603; Tolerance: ±0.1%
R17 R19 R20 R22 = CRT0603-BY-10R0ELF: RES SMD 10 OHM 0.1% 1/10W 0603; Manufacturer: Bourns Inc.; Power (Watts): 0.1W, 1/10W; Temperature Coefficient: ±25ppm/°C; Part Number: CRT0603-BY-10R0ELF; Value: 10 Ohms; ComponentLink1Description: Datasheet; ComponentLink1URL: https://www.bourns.com/docs/Product-Datasheets/crt.pdf; ComponentLink2Description: DigiKey Link; ComponentLink2URL: https://www.digikey.com/en/products/detail/bourns-inc/CRT0603-BY-10R0ELF/1775018; Composition: Thin Film; Device Package: 0603 (1608 Metric); Features: Current Sense; Height - Seated (Max): 0.024" (0.60mm); LastUpdated: 19/09/2022 1:22:34 PM; Lifecycle Status: Active; Minimum Order: 1; Number of Terminations: 2; Operating Temperature: -55°C ~ 155°C; Package / Case: 0603 (1608 Metric); Packaging: TapeAndReel; PartId: 4866; Part Status: Active; Price: 0.04; Resistance: 10 Ohms; Series: CRT; Size / Dimension: 0.061" L x 0.031" W (1.55mm x 0.80mm); Supplier 1: DigiKey; Supplier Part Number 1: CRT0603-BY-10R0ELFCT-ND; Supplier Device Package: 0603; Tolerance: ±0.1%
R18 R21 = PCS1206FR0020ET: 1W 0.002 OHMS 1% 1206; Manufacturer: Ohmite; Temperature Coefficient: ±50ppm/°C; Part Number: PCS1206FR0020ET; ComponentLink2Description: DigiKey Link; ComponentLink2URL: https://www.digikey.com/en/products/detail/ohmite/PCS1206FR0020ET/10670849; Composition: Metal Film; Device Package: 1206 (3216 Metric); Features: Current Sense; Height - Seated (Max): 0.035" (0.88mm); LastUpdated: 19/09/2022 1:42:39 PM; Lifecycle Status: Active; Minimum Order: 1; Number of Terminations: 2; Operating Temperature: -55°C ~ 170°C; Packaging: TapeAndReel; PartId: 2876; Part Status: Active; Power (Watts): 1W; Price: 0.21; Ratings: AEC-Q200; Resistance: 2 mOhms; Series: PCS; Size / Dimension: 0.126" L x 0.065" W (3.20mm x 1.65mm); Supplier 1: DigiKey; Supplier Part Number 1: 273-PCS1206FR0020ETCT-ND; Supplier Device Package: 1206; Tolerance: ±1%; Value: 2 mOhms
U5 U6 = INA226AIDGSR: MF: {'manufacturer': u'Texas Instruments'}; Value: *; MP: INA226AIDGSR; Price: None; Availability: Unavailable; Package: None

## Nets that join several sheets
3V3: Microcontroller (24 pins), Power_Regulation (J5.1 R14.2), Power_Measurement (11 pins)
GND: Microcontroller (21 pins), USB-C_Connectors (20 pins), Power_Regulation (8 pins), Power_Measurement (5 pins)
NetD1_1: Microcontroller (U1.3), USB-C_Connectors (D1.1 J3.A6 J3.B6)
NetD2_1: Microcontroller (U1.4), USB-C_Connectors (D2.1 J3.A7 J3.B7)
NetJ1_A4: USB-C_Connectors (J1.A4 J1.A9 J1.B4 J1.B9), Power_Regulation (J8.1), Power_Measurement (R21.1 R22.1 U5.8)
NetJ2_A4: USB-C_Connectors (J2.A4 J2.A9 J2.B4 J2.B9), Power_Regulation (J9.1 S3.3), Power_Measurement (R17.1 R18.2 U6.8)
NetJ3_A4: Microcontroller (R2.2), USB-C_Connectors (J3.A4 J3.A9 J3.B4 J3.B9), Power_Regulation (J10.1 S3.1)
NetR10_2: Microcontroller (U2.42), Power_Measurement (R10.2 U5.4 U6.4)
NetR11_2: Microcontroller (U2.39), Power_Measurement (R11.2 U5.5 U6.5)
NetR12_2: Microcontroller (U2.35), Power_Measurement (R12.2 U5.3)
NetR13_2: Microcontroller (U2.38), Power_Measurement (R13.2 U6.3)